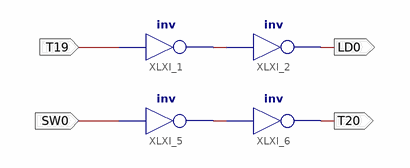
[diagram p0: schematic sheet 1]
// Xilinx ISE schematic main.sch (spartan6) as structural Verilog: 4 symbols, 4 ports
module main (
  input  T19,
  input  SW0,
  output LD0,
  output T20
);

  wire XLXN_2, XLXN_7;

  not XLXI_1 (XLXN_2, T19);
  not XLXI_2 (LD0, XLXN_2);
  not XLXI_5 (XLXN_7, SW0);
  not XLXI_6 (T20, XLXN_7);
endmodule
